# Altium project Gastroscopy-Tool-Sensor.PrjPcb
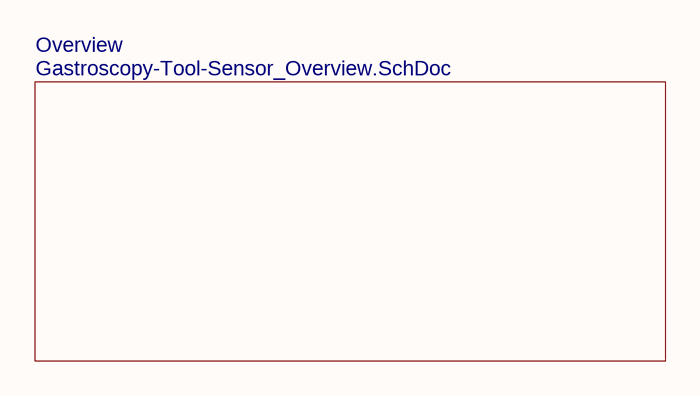
[diagram p0: Gastroscopy-Controller_Title.SchDoc]
GlobalAddress1: nab. reki Karpovki, d. 5/3E; GlobalAddress2: Saint-Petersburg, 197022; GlobalAddress3: Ph: +7 (911) 701-51-99; GlobalCompanyName: MRobot, LCC; GlobalDocumentNumberDrawingASM: 0000-0000; GlobalDocumentNumberDrawingPCB: 0000-0000; GlobalDocumentNumberPCB: 0000-0000; GlobalDocumentNumberSCH: 0000-0000; GlobalDocumentSubtitle: Gastroscopy Tool Sensor; GlobalDocumentTitle: Gastroscopy Tool Sensor; GlobalEngineer: Podlesnyi Vasilii; GlobalJiraKey: GSTRTLSNS; GlobalProjectTitle: Gastroscopy Tool Sensor; GlobalRevisionBOM: 0.1.1; GlobalRevisionPCB: 0.1.1; GlobalRevisionSCH: 0.1.1
5 sheets, 23 parts. Net scope: hierarchical (ports join the sheet entries above them; power ports are global).
Board files: Gastroscopy-Tool-Sensor.PcbDoc, Gastroscopy-Tool-Base.PcbDoc
Sheets:
  Gastroscopy-Controller_Title.SchDoc
    Overview = Gastroscopy-Tool-Sensor_Overview.SchDoc
      TOF Sensor = Gastroscopy-Tool-Sensor_TOF.SchDoc
      LED Driver = Gastroscopy-Tool-Sensor_LED.SchDoc
      Connectors = Gastroscopy-Tool-Sensor_Connectors.SchDoc

## Sheet Gastroscopy-Controller_Title.SchDoc: not used
size 215 x 279 mm; PageSetup: Record=PageOptions|CenterHorizontal=True|CenterVertical=True|PrintScale=0.94|XCorrection=1.00|YCorrection=1.00|PrintKind=0|BorderSize=5000000|LeftOffset=0|BottomOffset=0|Orientation=2|PaperLength=1000|PaperWidth=1000|Scale=100|PaperSource=15|PrintQuality=600|MediaType=1|DitherType=10|PrintScaleMode=1|PaperKind=Letter|PaperIndex=1; VersionControl_RevNumber: not used; IsUserConfigurable: not used; Date: not used; ApprovedBy: not used; CheckedBy: not used; Author: not used; CompanyName: MRobot, LCC; DrawnBy: not used; Engineer: not used; Organization: not used; Address1: not used; Address2: not used; Address3: not used; Address4: not used; DocumentNumber: 0000-0000; Revision: not used; SheetNumber: 1; SheetTotal: 5; DocumentTitle: Gastroscopy Tool Sensor; DocumentSubtitle: Gastroscopy Tool Sensor; ProjectTitle: Gastroscopy Tool Sensor; JiraKey: GSTRTLSNS; Time: not used; ImagePath: not used; Application_BuildNumber: not used

### Sub-sheets
Overview = Gastroscopy-Tool-Sensor_Overview.SchDoc: no entries

### Notes on the sheet
- Company:
- Project:
- Jira Key:

## Sheet Gastroscopy-Tool-Sensor_Overview.SchDoc: Overview
size 279 x 215 mm; Date: not used; ApprovedBy: not used; CheckedBy: not used; Author: not used; CompanyName: MRobot, LCC; DrawnBy: not used; Engineer: Podlesnyi Vasilii; Organization: not used; Address1: nab. reki Karpovki, d. 5/3E; Address2: Saint-Petersburg, 197022; Address3: Ph: +7 (911) 701-51-99; Address4: not used; DocumentNumber: 0000-0000; Revision: 0.1.1; SheetNumber: 2; SheetTotal: 5; ProjectTitle: Gastroscopy Tool Sensor; Time: not used; ImagePath: not used; Application_BuildNumber: not used
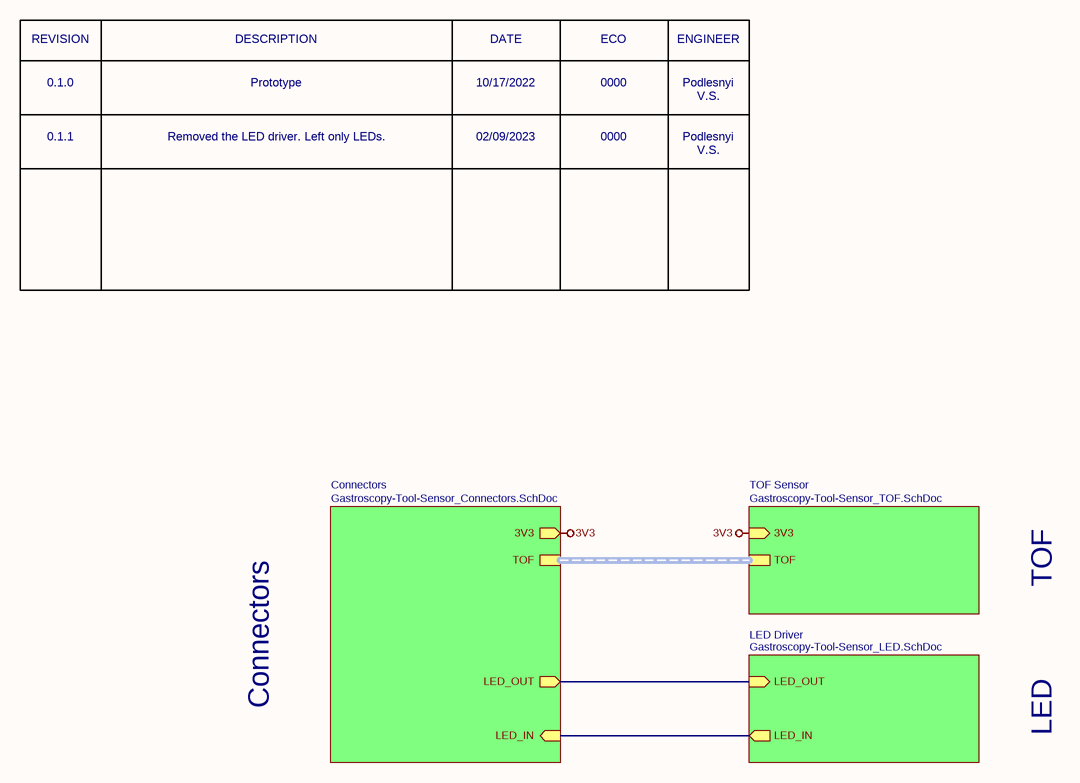
[diagram p1: Gastroscopy-Tool-Sensor_Overview.SchDoc]

### Sub-sheets
Connectors = Gastroscopy-Tool-Sensor_Connectors.SchDoc: TOF (harness TOF), LED_IN (in), LED_OUT (out), 3V3 (out)
LED Driver = Gastroscopy-Tool-Sensor_LED.SchDoc: LED_OUT (in), LED_IN (out)
TOF Sensor = Gastroscopy-Tool-Sensor_TOF.SchDoc: 3V3 (in), TOF (harness TOF)

### Nets
3V3: sheet TOF Sensor/3V3, sheet Connectors/3V3
LED_IN: sheet LED Driver/LED_IN, sheet Connectors/LED_IN
LED_OUT: sheet LED Driver/LED_OUT, sheet Connectors/LED_OUT

### Buses and harness runs
harness sheet Connectors/TOF = sheet TOF Sensor/TOF

### Notes on the sheet
- REVISION
- DESCRIPTION
- DATE
- ECO
- ENGINEER
- 0.1.0
- Prototype
- 10/17/2022
- 0000
- Podlesnyi V.S.
- 0.1.1
- Removed the LED driver. Left only LEDs.
- 02/09/2023
- TOF
- Connectors
- LED
- Title:
- Date:
- Size A
- Project:
- Number:
- Time:
- Sheet
- Revision
- of
- Engineer:
- www.mrobots.ru <http://mrobots.ru/>
- File:

## Sheet Gastroscopy-Tool-Sensor_TOF.SchDoc: TOF Sensor
size 279 x 215 mm; Date: not used; ApprovedBy: not used; CheckedBy: not used; Author: not used; CompanyName: MRobot, LCC; DrawnBy: not used; Engineer: Podlesnyi Vasilii; Organization: not used; Address1: nab. reki Karpovki, d. 5/3E; Address2: Saint-Petersburg, 197022; Address3: Ph: +7 (911) 701-51-99; Address4: not used; DocumentNumber: 0000-0000; Revision: 0.1.1; SheetNumber: 4; SheetTotal: 5; ProjectTitle: Gastroscopy Tool Sensor; Time: not used; ImagePath: not used; Application_BuildNumber: not used
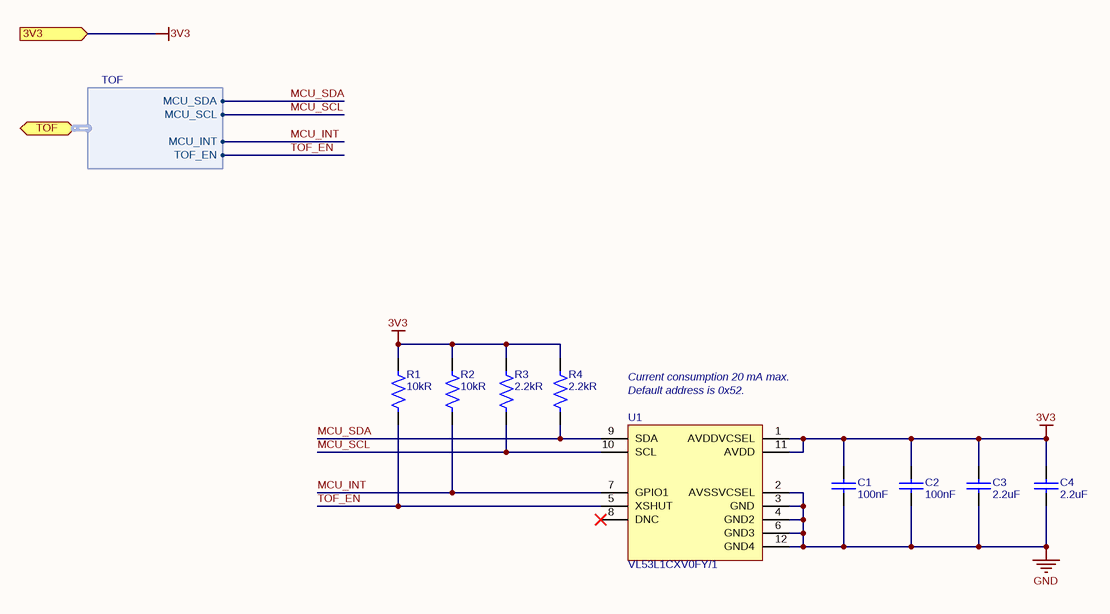
[diagram p2: Gastroscopy-Tool-Sensor_TOF.SchDoc]

### Parts
C1  100nF  [CAP_0402]
C2  100nF  [CAP_0402]
C3  2.2uF  [CAP_0402]
C4  2.2uF  [CAP_0402]
R1  10kR  [RES_0402]
R2  10kR  [RES_0402]
R3  2.2kR  [RES_0402]
R4  2.2kR  [RES_0402]
U1  VL53L1CXV0FY/1  [VL53L1CXV0FY/1]

### Ports
3V3 (in), TOF (bidir, harness TOF)

### Harnesses
TOF: MCU_SDA, MCU_SCL, MCU_INT, TOF_EN

### Nets
3V3: C1.2 C2.2 C3.2 C4.2 R1.1 R2.1 R3.1 R4.1 U1.1(AVDDVCSEL) U1.11(AVDD) ; port 3V3
GND: C1.1 C2.1 C3.1 C4.1 U1.2(AVSSVCSEL) U1.3(GND) U1.4(GND2) U1.6(GND3) U1.12(GND4)
MCU_INT: R2.2 U1.7(GPIO1) ; port TOF.MCU_INT
MCU_SCL: R3.2 U1.10(SCL) ; port TOF.MCU_SCL
MCU_SDA: R4.2 U1.9(SDA) ; port TOF.MCU_SDA
TOF_EN: R1.2 U1.5(XSHUT) ; port TOF.TOF_EN

Not connected (* = marked no-connect by the designer): U1 8(DNC)*

### Notes on the sheet
- (near U1) Default address is 0x52.
- Current consumption 20 mA max.
- Title:
- Date:
- Size A
- Project:
- Number:
- Time:
- Sheet
- Revision
- of
- Engineer:
- www.mrobots.ru <http://mrobots.ru/>
- File:

### Library data of the parts
C1 C2 = CC0402JRX7R8BB104: CAP CER 0.1UF 25V X7R 0402; Manufacturer: Yageo; Tolerance: 5%; Supplier 1: Mouser; Manufacturer Part Number: CC0402JRX7R8BB104; RoHS: Yes; Category: Ceramic Capacitors; Stock 1: 20266; Pricing 1: 1=0,10000, 10=0,03800, 50=0,03800, 100=0,03000, 1000=0,01700, 10000=0,01200 (USD); Case/Package: 0402; Voltage Rating (DC): 25V; Dielectric: X7R; Capacitance: 100nF; Lead Free: Lead Free; Halogen Free: Halogen Free; Supplier Part Number 1: 603-CC0402JR7R8BB104
C3 C4 = GRM155Z71A225KE44D: CAP CER 2.2UF 10V X7R 0402; Manufacturer: Murata; Supplier 1: Arrow Electronics; Manufacturer Part Number: GRM155Z71A225KE44D; RoHS: Yes; Category: Ceramic Capacitors; Stock 1: 100000; Pricing 1: 10000=0,02300, 20000=0,02230, 30000=0,02180, 50000=0,02160, 100000=0,02130 (USD); Case/Package: 0402; RoHS Compliant: Yes; Supplier Part Number 1: GRM155Z71A225KE44D; Voltage - Rated: 10V; Capacitance: 2.2uF
R1 R2 = RC0402FR-0710KL: RES 10K OHM 1% 1/16W 0402; Manufacturer: Yageo; Voltage Rating (DC): 50V; Temperature Coefficient: 100ppm/°C; Power Rating: 62.5mW; Max Power Dissipation: 63mW; Supplier 1: RSComponents; Manufacturer Part Number: RC0402FR-0710KL; RoHS: Yes; Category: Chip SMD Resistors; Stock 1: 279800; Pricing 1: 1000=0,00500, 2500=0,00400, 5000=0,00400, 10000=0,00400 (GBP); Case/Package: 0402; Number of Pins: 2; Case Code (Imperial): 0402; Case Code (Metric): 1005; Min Operating Temperature: -55°C; Max Operating Temperature: 155°C; Resistor Type: Thick Film; Resistance: 10kR; Tolerance: 1%; Packaging: Tape and Reel; Voltage Rating: 50V; Termination: SMD/SMT; Working Voltage: 50V; Number of Terminations: 2; Features: Moisture Resistant; Series: RC; Resistance Tolerance: 1%; Construction: Rectangular; Length: 1mm; Width: 0.5mm; Height: 0.32mm; Depth: 0.5mm; Lead Pitch: 0.2mm; Lead Free: Lead Free; RoHS Compliant: Yes; Military Standard: Not; ComponentLink1URL: https://datasheet.ciiva.com/7660/38568-7660787.pdf?src-supplier=Element14; ComponentLink1Description: https://datasheet.ciiva.com/7660/38568-7660787.pdf?src-supplier=Element14; ComponentLink2URL: https://datasheet.ciiva.com/7849/1686128-7849814.pdf?src-supplier=Element14; ComponentLink2Description: https://datasheet.ciiva.com/7849/1686128-7849814.pdf?src-supplier=Element14; ComponentLink3URL: https://datasheet.ciiva.com/7983/1018594-7983486.pdf?src-supplier=Element14; ComponentLink3Description: https://datasheet.ciiva.com/7983/1018594-7983486.pdf?src-supplier=Element14; ComponentLink4URL: https://datasheet.ciiva.com/22747/1018594-22747512.pdf?src-supplier=Element14; ComponentLink4Description: https://datasheet.ciiva.com/22747/1018594-22747512.pdf?src-supplier=Element14; ComponentLink5URL: https://datasheet.ciiva.com/12667/pyu-rc0402-51-rohs-l-6-r-12667067.pdf?src-supplier=Mouser; ComponentLink5Description: https://datasheet.ciiva.com/12667/pyu-rc0402-51-rohs-l-6-r-12667067.pdf?src-supplier=Mouser; ComponentLink6URL: https://datasheet.ciiva.com/7849/1784430-7849813.pdf?src-supplier=Element14; ComponentLink6Description: https://datasheet.ciiva.com/7849/1784430-7849813.pdf?src-supplier=Element14; ComponentLink7URL: https://datasheet.ciiva.com/7849/1784430-7849815.pdf?src-supplier=Element14; ComponentLink7Description: https://datasheet.ciiva.com/7849/1784430-7849815.pdf?src-supplier=Element14; Supplier Part Number 1: 1987644P
R3 R4 = RC0402FR-072K2L: RES 2.2K OHM 1% 1/16W 0402; Manufacturer: Yageo; Power Rating: 62.5mW; Voltage Rating: 50V; Temperature Coefficient: 100ppm/°C; Max Power Dissipation: 63mW; Supplier 1: RSComponents; Manufacturer Part Number: RC0402FR-072K2L; RoHS: Yes; Category: Chip SMD Resistors; Stock 1: 12100; Pricing 1: 100=0,03500, 500=0,03300, 1000=0,03000, 2500=0,02700, 5000=0,02500 (GBP); Case/Package: 0402; Case Code (Imperial): 0402; Case Code (Metric): 1005; Weight: 2.3E-05oz; Size Code: 0402; Min Operating Temperature: -55°C; Max Operating Temperature: 155°C; Resistor Type: Thick Film; Packaging: Tape and Reel; Resistance: 2.2kR; Tolerance: 1%; Termination: SMD/SMT; Features: Moisture Resistant; Series: RC; Number of Terminations: 2; Resistance Tolerance: 1%; Construction: Rectangular; Technology: THICK FILM; Length: 1mm; Width: 0.5mm; Height: 0.35mm; Depth: 0.5mm; RoHS Compliant: Yes; Reach SVHC Compliant: Yes; Military Standard: Not; Lead Free: Lead Free; ComponentLink1URL: https://datasheet.ciiva.com/11808/0900766b80c66297-11808786.pdf?src-supplier=RSComponents; ComponentLink1Description: https://datasheet.ciiva.com/11808/0900766b80c66297-11808786.pdf?src-supplier=RSComponents; ComponentLink2URL: https://datasheet.ciiva.com/7983/1018594-7983515.pdf?src-supplier=Element14; ComponentLink2Description: https://datasheet.ciiva.com/7983/1018594-7983515.pdf?src-supplier=Element14; ComponentLink3URL: https://datasheet.ciiva.com/46383/1018594-46383563.pdf?src-supplier=Element14; ComponentLink3Description: https://datasheet.ciiva.com/46383/1018594-46383563.pdf?src-supplier=Element14; ComponentLink4URL: https://datasheet.ciiva.com/12577/pyu-rc0402-51-rohs-l-6-r-12577429.pdf?src-supplier=Mouser; ComponentLink4Description: https://datasheet.ciiva.com/12577/pyu-rc0402-51-rohs-l-6-r-12577429.pdf?src-supplier=Mouser; ComponentLink5URL: https://datasheet.ciiva.com/7849/1018594-7849929.pdf?src-supplier=Element14; ComponentLink5Description: https://datasheet.ciiva.com/7849/1018594-7849929.pdf?src-supplier=Element14; ComponentLink6URL: https://datasheet.ciiva.com/7849/1018594-7849928.pdf?src-supplier=Element14; ComponentLink6Description: https://datasheet.ciiva.com/7849/1018594-7849928.pdf?src-supplier=Element14; ComponentLink7URL: https://datasheet.ciiva.com/16741/pyu-rc0402-51-rohs-l-6-r-16741015.pdf?src-supplier=Future+Electronics; ComponentLink7Description: https://datasheet.ciiva.com/16741/pyu-rc0402-51-rohs-l-6-r-16741015.pdf?src-supplier=Future+Electronics; Supplier Part Number 1: 1987731
U1 = VL53L1CXV0FY/1: SENSOR OPTICAL 4M I2C; Manufacturer 1: STMicroelectronics; Supplier 1: Avnet; Manufacturer Part Number 1: VL53L1CXV0FY/1; RoHS: Yes; Category: Proximity Sensors; Stock 1: 143; Pricing 1: 1=7,70000, 10=7,03000, 25=6,73000, 50=6,33000, 100=5,94000, 250=5,71000 (USD); Min Operating Temperature: -20°C; Max Operating Temperature: 85°C; Output Type: I2C; RoHS Compliant: Yes; ComponentLink1URL: http://www.farnell.com/datasheets/2600105.pdf?src-supplier=Farnell; ComponentLink1Description: http://www.farnell.com/datasheets/2600105.pdf?src-supplier=Farnell; ComponentLink2URL: http://www.st.com/content/ccc/resource/technical/document/datasheet/group3/7d/85/c8/95/fb/3b/4e/2d/DM00452094/files/DM00452094.pdf/jcr:content/translations/en.DM00452094.pdf?src-supplier=Digi-Key; ComponentLink2Description: http://www.st.com/content/ccc/resource/technical/document/datasheet/group3/7d/85/c8/95/fb/3b/4e/2d/DM00452094/files/DM00452094.pdf/jcr:content/translations/en.DM00452094.pdf?src-supplier=Digi-Key; ComponentLink3URL: https://www.st.com/resource/en/datasheet/vl53l1x.pdf?src-supplier=Digi-Key; ComponentLink3Description: https://www.st.com/resource/en/datasheet/vl53l1x.pdf?src-supplier=Digi-Key; Supplier Part Number 1: 52AC7854

## Sheet Gastroscopy-Tool-Sensor_LED.SchDoc: LED Driver
size 279 x 215 mm; Date: not used; ApprovedBy: not used; CheckedBy: not used; Author: not used; CompanyName: MRobot, LCC; DrawnBy: not used; Engineer: Podlesnyi Vasilii; Organization: not used; Address1: nab. reki Karpovki, d. 5/3E; Address2: Saint-Petersburg, 197022; Address3: Ph: +7 (911) 701-51-99; Address4: not used; DocumentNumber: 0000-0000; Revision: 0.1.1; SheetNumber: 5; SheetTotal: 5; ProjectTitle: Gastroscopy Tool Sensor; Time: not used; ImagePath: not used; Application_BuildNumber: not used
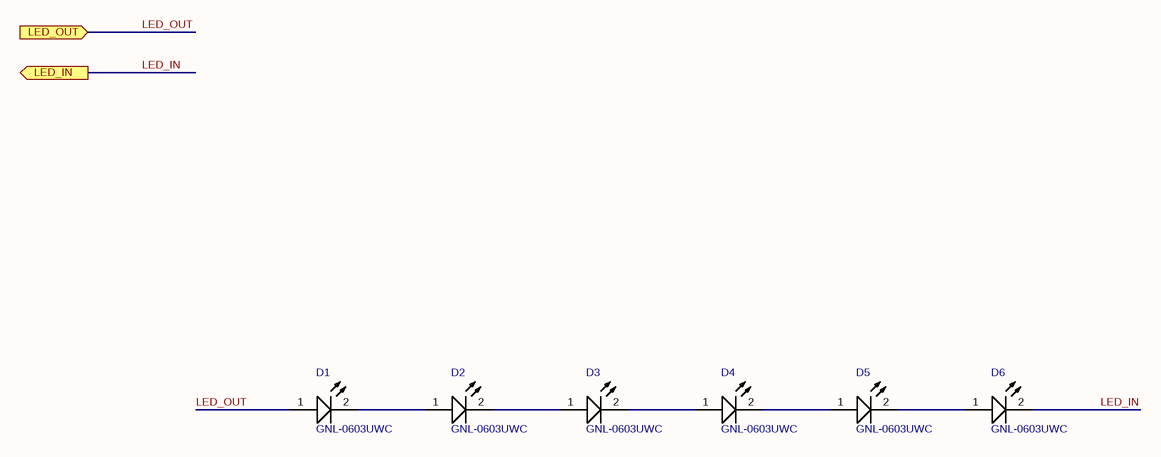
[diagram p3: Gastroscopy-Tool-Sensor_LED.SchDoc]

### Parts
D1  GNL-0603UWC  [L_0603_WHITE]
D2  GNL-0603UWC  [L_0603_WHITE]
D3  GNL-0603UWC  [L_0603_WHITE]
D4  GNL-0603UWC  [L_0603_WHITE]
D5  GNL-0603UWC  [L_0603_WHITE]
D6  GNL-0603UWC  [L_0603_WHITE]

### Ports
LED_IN (out), LED_OUT (in)

### Nets
LED_IN: D6.2(K) ; port LED_IN
LED_OUT: D1.1(A) ; port LED_OUT
NetD1_2: D1.2(K) D2.1(A)
NetD2_2: D2.2(K) D3.1(A)
NetD3_2: D3.2(K) D4.1(A)
NetD4_2: D4.2(K) D5.1(A)
NetD5_2: D5.2(K) D6.1(A)

### Notes on the sheet
- Title:
- Date:
- Size A
- Project:
- Number:
- Time:
- Sheet
- Revision
- of
- Engineer:
- www.mrobots.ru <http://mrobots.ru/>
- File:

### Library data of the parts
D1-D6 = GNL-0603UWC: LED WHITE CLEAR SMD; Manufacturer 1: G-nor Electronics; Manufacturer Part Number 1: GNL-0603UWC

## Sheet Gastroscopy-Tool-Sensor_Connectors.SchDoc: Connectors
size 279 x 215 mm; Date: not used; ApprovedBy: not used; CheckedBy: not used; Author: not used; CompanyName: MRobot, LCC; DrawnBy: not used; Engineer: Podlesnyi Vasilii; Organization: not used; Address1: nab. reki Karpovki, d. 5/3E; Address2: Saint-Petersburg, 197022; Address3: Ph: +7 (911) 701-51-99; Address4: not used; DocumentNumber: 0000-0000; Revision: 0.1.1; SheetNumber: 3; SheetTotal: 5; ProjectTitle: Gastroscopy Tool Sensor; Time: not used; ImagePath: not used; Application_BuildNumber: not used
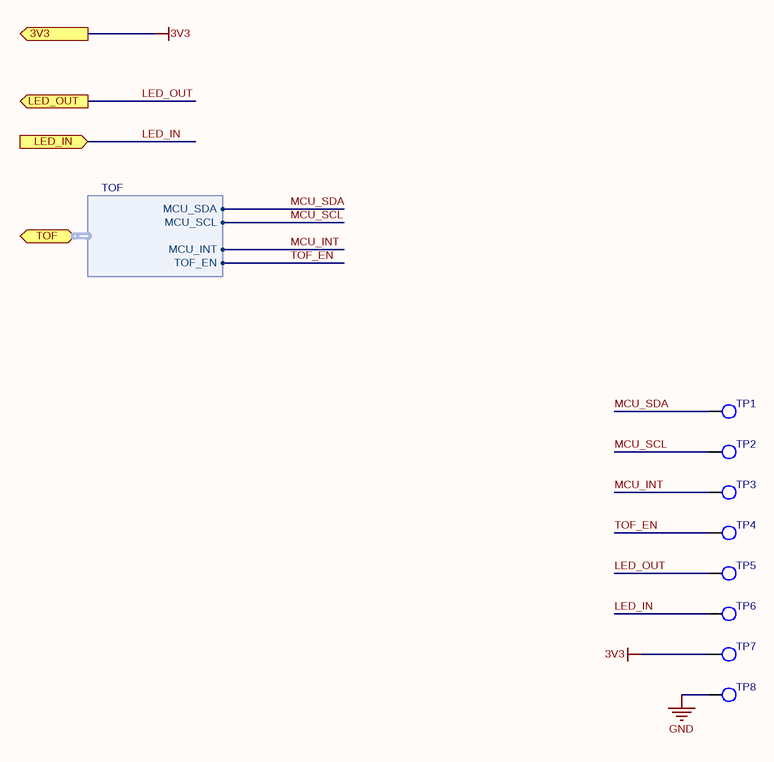
[diagram p4: Gastroscopy-Tool-Sensor_Connectors.SchDoc]

### Parts
TP1  TEST_POINT_SMT  [TEST_POINT_TH]  (value not drawn)  (no BOM)
TP2  TEST_POINT_SMT  [TEST_POINT_TH]  (value not drawn)  (no BOM)
TP3  TEST_POINT_SMT  [TEST_POINT_TH]  (value not drawn)  (no BOM)
TP4  TEST_POINT_SMT  [TEST_POINT_TH]  (value not drawn)  (no BOM)
TP5  TEST_POINT_SMT  [TEST_POINT_TH]  (value not drawn)  (no BOM)
TP6  TEST_POINT_SMT  [TEST_POINT_TH]  (value not drawn)  (no BOM)
TP7  TEST_POINT_SMT  [TEST_POINT_TH]  (value not drawn)  (no BOM)
TP8  TEST_POINT_SMT  [TEST_POINT_TH]  (value not drawn)  (no BOM)

### Ports
3V3 (out), LED_IN (in), LED_OUT (out), TOF (bidir, harness TOF)

### Harnesses
TOF: MCU_SDA, MCU_SCL, MCU_INT, TOF_EN

### Nets
3V3: TP7.1 ; port 3V3
GND: TP8.1
LED_IN: TP6.1 ; port LED_IN
LED_OUT: TP5.1 ; port LED_OUT
MCU_INT: TP3.1 ; port TOF.MCU_INT
MCU_SCL: TP2.1 ; port TOF.MCU_SCL
MCU_SDA: TP1.1 ; port TOF.MCU_SDA
TOF_EN: TP4.1 ; port TOF.TOF_EN

### Notes on the sheet
- Title:
- Date:
- Size A
- Project:
- Number:
- Time:
- Sheet
- Revision
- of
- Engineer:
- www.mrobots.ru <http://mrobots.ru/>
- File:

### Library data of the parts
TP1-TP8 = TEST_POINT_SMT: STM TEST POINT

## Nets that join several sheets
3V3: Gastroscopy-Tool-Sensor_TOF (10 pins), Gastroscopy-Tool-Sensor_Connectors (TP7.1)
GND: Gastroscopy-Tool-Sensor_TOF (9 pins), Gastroscopy-Tool-Sensor_Connectors (TP8.1)
LED_IN: Gastroscopy-Tool-Sensor_LED (D6.2), Gastroscopy-Tool-Sensor_Connectors (TP6.1)
LED_OUT: Gastroscopy-Tool-Sensor_LED (D1.1), Gastroscopy-Tool-Sensor_Connectors (TP5.1)
MCU_INT: Gastroscopy-Tool-Sensor_TOF (R2.2 U1.7), Gastroscopy-Tool-Sensor_Connectors (TP3.1)
MCU_SCL: Gastroscopy-Tool-Sensor_TOF (R3.2 U1.10), Gastroscopy-Tool-Sensor_Connectors (TP2.1)
MCU_SDA: Gastroscopy-Tool-Sensor_TOF (R4.2 U1.9), Gastroscopy-Tool-Sensor_Connectors (TP1.1)
TOF_EN: Gastroscopy-Tool-Sensor_TOF (R1.2 U1.5), Gastroscopy-Tool-Sensor_Connectors (TP4.1)